# EAGLE board tablet (EAGLE 8.4.3), part 1 of 2
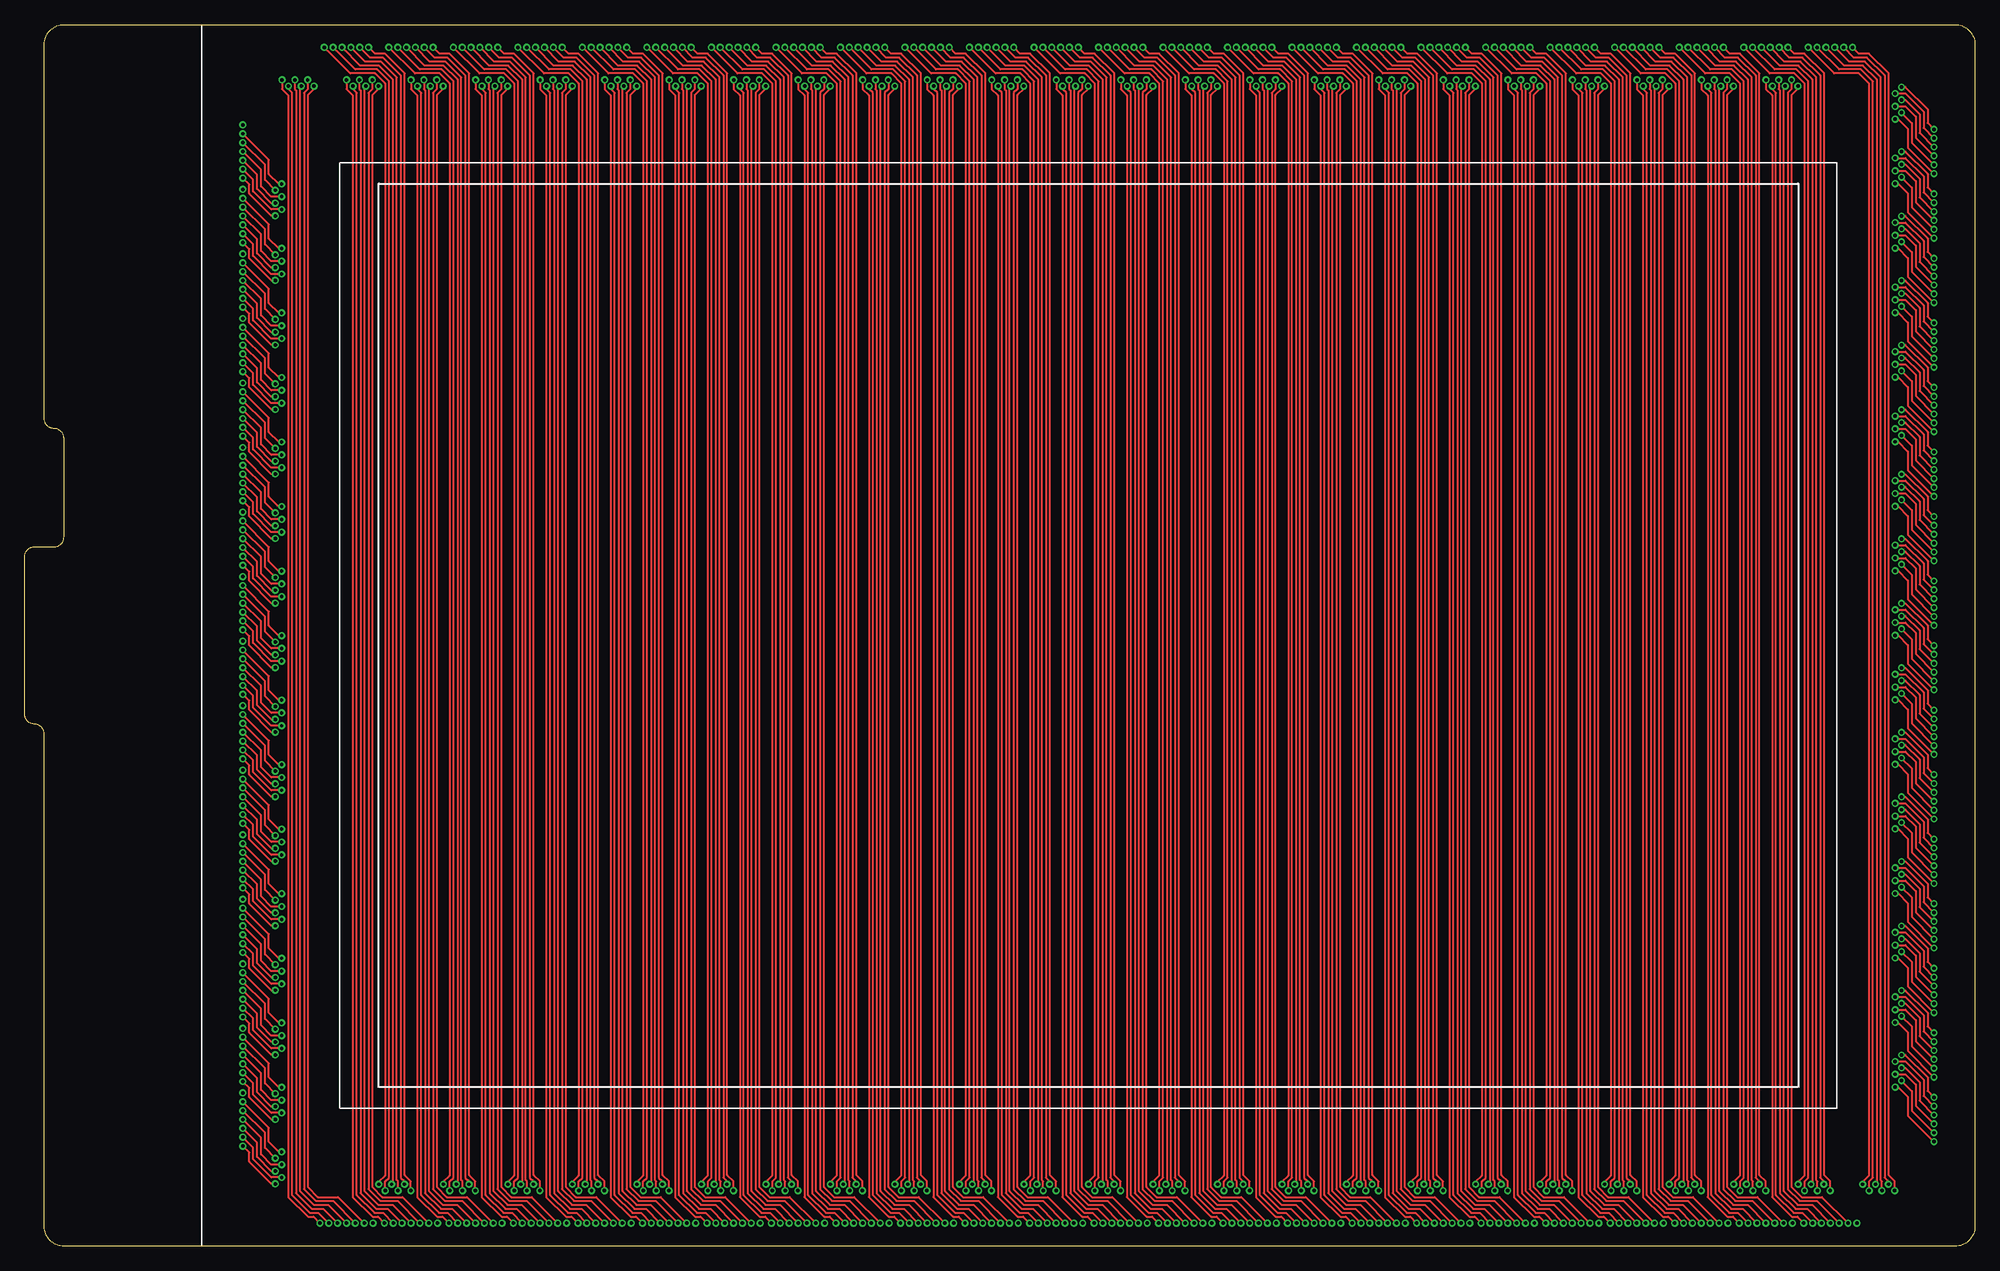
[diagram p1: board, top side]
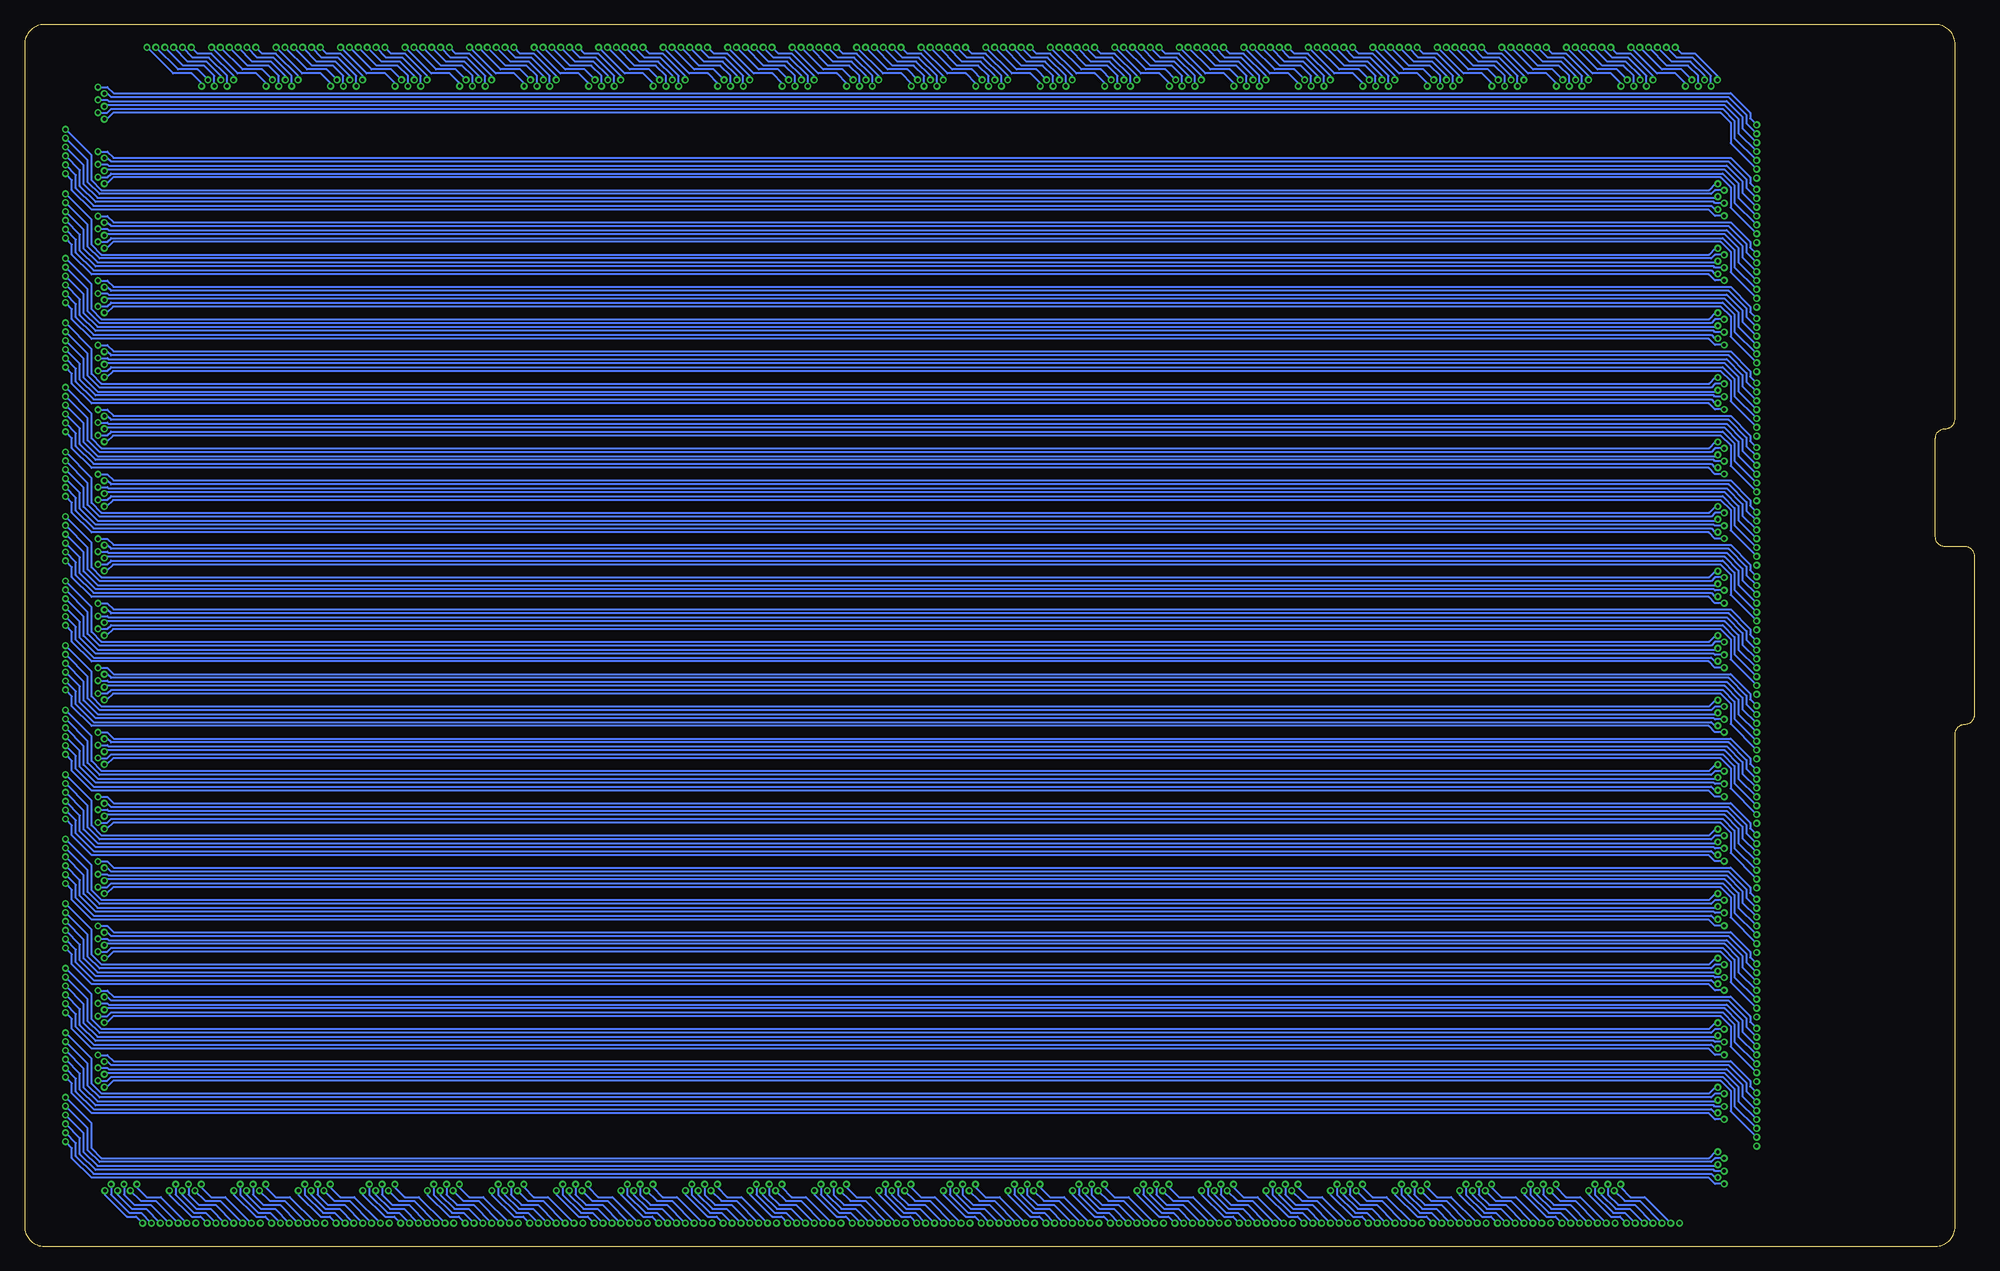
[diagram p2: board, bottom side, seen from below]

Size 198 x 124 mm. Coordinates in mm from the lower left corner, seen from the top.
Outline: 198,122 198,2 arc-90 196,0 4,0 arc-90 2,2 2,52 arc90 1,53 arc-90 0,54 0,70 arc-90 1,71 3,71 arc90 4,72 4,82 arc90 3,83 arc-90 2,84 2,122 arc-90 4,124 196,124 arc-90 198,122
Copper layers (1*16): Top 0.035mm / dielectric 0.9mm / Bottom 0.035mm
Design rules "default *": minimum track width 0.15mm, minimum drill 0.3mm, track to track 0.15mm, track to pad 0.15mm, pad to pad 0.15mm, via to via 0.15mm, smd to smd 0.15mm, copper to edge 0.5mm, drill to drill 0.255mm, minimum pad ring 0.15mm, minimum via ring 0.15mm, stop-mask expansion 0.1mm, vias tented up to drill 0.45mm, thermal gap 0.25mm

## Footprints (pad centres in the part's own frame; a part is rotated, then mirrored left to right if it is on the bottom)
0603 = smd 0.8 x 0.8: 1 -0.75,0; 2 0.75,0
SOT23_3 = smd 0.75 x 1.25: 1 -0.95,-1.25; 2 0.95,-1.25; 3 0,1.25
SOD323 = smd 1.2 x 1.2: 1 -1.25,0; 2 1.25,0
SOIC8 = smd 0.6 x 2.2: 1 -1.905,-2.6; 2 -0.635,-2.6; 3 0.635,-2.6; 4 1.905,-2.6; 5 1.905,2.6; 6 0.635,2.6; 7 -0.635,2.6; 8 -1.905,2.6
SOT23_5 = smd 0.5 x 1.25: 1 -0.95,-1.25; 2 0,-1.25; 3 0.95,-1.25; 4 0.95,1.25; 5 -0.95,1.25

## Placement (x,y rotation side)
C1  ~470pF  [0603]  -1,-32 0 top  (outside the outline)
C2  100nF  [0603]  -21,-38 0 top  (outside the outline)
C3  100nF  [0603]  -21,-41 0 top  (outside the outline)
C4  100nF  [0603]  -21,-44 0 top  (outside the outline)
C5  100nF  [0603]  -26,-54 0 top  (outside the outline)
C6  1uF  [0603]  -26,-57 0 top  (outside the outline)
C7  100nF  [0603]  -26,-60 0 top  (outside the outline)
D1  BAT721S  [SOT23_3]  9,-18 0 top  (outside the outline)
D2  3V9  [SOD323]  0,-35 0 top  (outside the outline)
D3  5V1  [SOD323]  -31,-70 0 top  (outside the outline)
D4  5V1  [SOD323]  -31,-73 0 top  (outside the outline)
IC1  [SOIC8]  -5,-21 0 top  (outside the outline)
IC2  MCP3201  [SOIC8]  -15,-30 0 top  (outside the outline)
IC4  MAX6104EUR  [SOT23_3]  -21,-49 0 top  (outside the outline)
IC5  MAX4514EUK  [SOT23_5]  -25,-65 0 top  (outside the outline)
R1  TBD  [0603]  9,-23 0 top  (outside the outline)
R2  1K  [0603]  9,-26 0 top  (outside the outline)
R3  1K  [0603]  -5,-29 0 top  (outside the outline)

## Tracks (layer width: path | path; a pad name or v marks a point on that pad's centre or on a via)
+5V  (7 unrouted)
-5V  (1 unrouted)
GND  (12 unrouted)
N$1  (2 unrouted)
N$2  (3 unrouted)
N$3  (1 unrouted)
N$4  (4 unrouted)
N$5  (1 unrouted)
N$6  (2 unrouted)
SIG  (1 unrouted)
VOUT  (4 unrouted)
X0  (via drill 0.35 pad 0.7)
  Top 0.2: v30.88,2.35 29.83,3.4 28.96,3.4 27.16,5.2 27.16,117.08 26.79,117.45 v26.79,117.75 | v31.78,2.35 30.33,3.8 29.16,3.8 27.56,5.4 27.56,117.33 27.44,117.45 v27.44,118.4 | v32.67,2.35 30.83,4.2 29.36,4.2 27.96,5.6 27.96,117.62 v28.09,117.75 | v33.58,2.35 31.33,4.6 29.56,4.6 28.36,5.8 28.36,117.08 28.74,117.45 v28.74,118.4 | v34.47,2.35 31.83,5 29.76,5 28.76,6 28.76,116.88 29.39,117.5 v29.39,117.75 | v29.97,2.35 29.33,3 28.76,3 26.76,5 26.76,116.83 26.14,117.45 v26.14,118.4 | v37.26,6.3 37.39,6.42 37.39,118.45 35.99,119.85 34.08,119.85 v32.22,121.7 | v37.91,5.65 37.91,6.6 37.79,6.73 37.79,118.65 36.19,120.25 34.58,120.25 v33.12,121.7 | v38.56,6.3 38.56,6.6 38.19,6.98 38.19,118.85 36.39,120.65 35.08,120.65 v34.03,121.7 | v39.21,5.65 39.21,6.6 38.59,7.23 38.59,119.05 36.59,121.05 35.58,121.05 v34.92,121.7 | v36.61,5.65 36.61,6.6 36.99,6.98 36.99,118.25 35.79,119.45 33.58,119.45 v31.33,121.7 | v35.96,6.3 35.96,6.55 36.59,7.17 36.59,118.05 35.59,119.05 33.08,119.05 v30.42,121.7
  Bottom 0.2: v39.21,5.65 39.21,5.25 36.96,3 36.03,3 v35.38,2.35 | v38.56,6.3 38.56,5.25 36.71,3.4 35.53,3.4 v34.47,2.35 | v37.26,6.3 37.26,5.25 36.21,4.2 34.53,4.2 v32.67,2.35 | v37.91,5.65 37.91,5.25 36.46,3.8 35.03,3.8 v33.58,2.35 | v36.61,5.65 35.56,4.6 34.03,4.6 v31.78,2.35 | v35.96,6.3 35.96,6 34.96,5 33.53,5 v30.88,2.35 | v26.14,118.4 26.14,118.8 28.39,121.05 29.78,121.05 v30.42,121.7 | v26.79,117.75 26.79,118.8 28.64,120.65 30.28,120.65 v31.33,121.7 | v28.09,117.75 28.09,118.8 29.14,119.85 31.28,119.85 v33.12,121.7 | v27.44,118.4 27.44,118.8 28.89,120.25 30.78,120.25 v32.22,121.7 | v28.74,118.4 29.79,119.45 31.78,119.45 v34.03,121.7 | v29.39,117.75 29.39,118.05 30.39,119.05 32.28,119.05 v34.92,121.7
X1  (via drill 0.35 pad 0.7)
  Top 0.2: v37.42,2.35 36.38,3.4 35.51,3.4 33.71,5.2 33.71,117.08 33.34,117.45 v33.34,117.75 | v38.33,2.35 36.88,3.8 35.71,3.8 34.11,5.4 34.11,117.33 33.99,117.45 v33.99,118.4 | v39.22,2.35 37.38,4.2 35.91,4.2 34.51,5.6 34.51,117.62 v34.64,117.75 | v40.12,2.35 37.88,4.6 36.11,4.6 34.91,5.8 34.91,117.08 35.29,117.45 v35.29,118.4 | v41.03,2.35 38.38,5 36.31,5 35.31,6 35.31,116.88 35.94,117.5 v35.94,117.75 | v36.53,2.35 35.88,3 35.31,3 33.31,5 33.31,116.83 32.69,117.45 v32.69,118.4 | v43.81,6.3 43.94,6.42 43.94,118.45 42.54,119.85 40.62,119.85 v38.78,121.7 | v44.46,5.65 44.46,6.6 44.34,6.73 44.34,118.65 42.74,120.25 41.12,120.25 v39.67,121.7 | v45.11,6.3 45.11,6.6 44.74,6.98 44.74,118.85 42.94,120.65 41.62,120.65 v40.58,121.7 | v45.76,5.65 45.76,6.6 45.14,7.23 45.14,119.05 43.14,121.05 42.12,121.05 v41.47,121.7 | v43.16,5.65 43.16,6.6 43.54,6.98 43.54,118.25 42.34,119.45 40.12,119.45 v37.88,121.7 | v42.51,6.3 42.51,6.55 43.14,7.17 43.14,118.05 42.14,119.05 39.62,119.05 v36.97,121.7
  Bottom 0.2: v45.76,5.65 45.76,5.25 43.51,3 42.58,3 v41.92,2.35 | v45.11,6.3 45.11,5.25 43.26,3.4 42.08,3.4 v41.03,2.35 | v43.81,6.3 43.81,5.25 42.76,4.2 41.08,4.2 v39.22,2.35 | v44.46,5.65 44.46,5.25 43.01,3.8 41.58,3.8 v40.12,2.35 | v43.16,5.65 42.11,4.6 40.58,4.6 v38.33,2.35 | v42.51,6.3 42.51,6 41.51,5 40.08,5 v37.42,2.35 | v32.69,118.4 32.69,118.8 34.94,121.05 36.33,121.05 v36.97,121.7 | v33.34,117.75 33.34,118.8 35.19,120.65 36.83,120.65 v37.88,121.7 | v34.64,117.75 34.64,118.8 35.69,119.85 37.83,119.85 v39.67,121.7 | v33.99,118.4 33.99,118.8 35.44,120.25 37.33,120.25 v38.78,121.7 | v35.29,118.4 36.34,119.45 38.33,119.45 v40.58,121.7 | v35.94,117.75 35.94,118.05 36.94,119.05 38.83,119.05 v41.47,121.7
X2  (via drill 0.35 pad 0.7)
  Top 0.2: v43.97,2.35 42.92,3.4 42.06,3.4 40.26,5.2 40.26,117.08 39.89,117.45 v39.89,117.75 | v44.88,2.35 43.42,3.8 42.26,3.8 40.66,5.4 40.66,117.33 40.54,117.45 v40.54,118.4 | v45.77,2.35 43.92,4.2 42.46,4.2 41.06,5.6 41.06,117.62 v41.19,117.75 | v46.67,2.35 44.42,4.6 42.66,4.6 41.46,5.8 41.46,117.08 41.84,117.45 v41.84,118.4 | v47.58,2.35 44.92,5 42.86,5 41.86,6 41.86,116.88 42.49,117.5 v42.49,117.75 | v43.08,2.35 42.42,3 41.86,3 39.86,5 39.86,116.83 39.24,117.45 v39.24,118.4 | v50.36,6.3 50.49,6.42 50.49,118.45 49.09,119.85 47.17,119.85 v45.33,121.7 | v51.01,5.65 51.01,6.6 50.89,6.73 50.89,118.65 49.29,120.25 47.67,120.25 v46.23,121.7 | v51.66,6.3 51.66,6.6 51.29,6.98 51.29,118.85 49.49,120.65 48.17,120.65 v47.12,121.7 | v52.31,5.65 52.31,6.6 51.69,7.23 51.69,119.05 49.69,121.05 48.67,121.05 v48.02,121.7 | v49.71,5.65 49.71,6.6 50.09,6.98 50.09,118.25 48.89,119.45 46.67,119.45 v44.42,121.7 | v49.06,6.3 49.06,6.55 49.69,7.17 49.69,118.05 48.69,119.05 46.17,119.05 v43.53,121.7
  Bottom 0.2: v52.31,5.65 52.31,5.25 50.06,3 49.12,3 v48.48,2.35 | v51.66,6.3 51.66,5.25 49.81,3.4 48.62,3.4 v47.58,2.35 | v50.36,6.3 50.36,5.25 49.31,4.2 47.62,4.2 v45.77,2.35 | v51.01,5.65 51.01,5.25 49.56,3.8 48.12,3.8 v46.67,2.35 | v49.71,5.65 48.66,4.6 47.12,4.6 v44.88,2.35 | v49.06,6.3 49.06,6 48.06,5 46.62,5 v43.97,2.35 | v39.24,118.4 39.24,118.8 41.49,121.05 42.88,121.05 v43.53,121.7 | v39.89,117.75 39.89,118.8 41.74,120.65 43.38,120.65 v44.42,121.7 | v41.19,117.75 41.19,118.8 42.24,119.85 44.38,119.85 v46.23,121.7 | v40.54,118.4 40.54,118.8 41.99,120.25 43.88,120.25 v45.33,121.7 | v41.84,118.4 42.89,119.45 44.88,119.45 v47.12,121.7 | v42.49,117.75 42.49,118.05 43.49,119.05 45.38,119.05 v48.02,121.7
X3  (via drill 0.35 pad 0.7)
  Top 0.2: v50.52,2.35 49.48,3.4 48.61,3.4 46.81,5.2 46.81,117.08 46.44,117.45 v46.44,117.75 | v51.42,2.35 49.98,3.8 48.81,3.8 47.21,5.4 47.21,117.33 47.09,117.45 v47.09,118.4 | v52.33,2.35 50.48,4.2 49.01,4.2 47.61,5.6 47.61,117.62 v47.74,117.75 | v53.23,2.35 50.98,4.6 49.21,4.6 48.01,5.8 48.01,117.08 48.39,117.45 v48.39,118.4 | v54.12,2.35 51.48,5 49.41,5 48.41,6 48.41,116.88 49.04,117.5 v49.04,117.75 | v49.62,2.35 48.98,3 48.41,3 46.41,5 46.41,116.83 45.79,117.45 v45.79,118.4 | v56.91,6.3 57.04,6.42 57.04,118.45 55.64,119.85 53.73,119.85 v51.88,121.7 | v57.56,5.65 57.56,6.6 57.44,6.73 57.44,118.65 55.84,120.25 54.23,120.25 v52.77,121.7 | v58.21,6.3 58.21,6.6 57.84,6.98 57.84,118.85 56.04,120.65 54.73,120.65 v53.67,121.7 | v58.86,5.65 58.86,6.6 58.24,7.23 58.24,119.05 56.24,121.05 55.23,121.05 v54.58,121.7 | v56.26,5.65 56.26,6.6 56.64,6.98 56.64,118.25 55.44,119.45 53.23,119.45 v50.98,121.7 | v55.61,6.3 55.61,6.55 56.24,7.17 56.24,118.05 55.24,119.05 52.73,119.05 v50.08,121.7
  Bottom 0.2: v58.86,5.65 58.86,5.25 56.61,3 55.67,3 v55.02,2.35 | v58.21,6.3 58.21,5.25 56.36,3.4 55.17,3.4 v54.12,2.35 | v56.91,6.3 56.91,5.25 55.86,4.2 54.17,4.2 v52.33,2.35 | v57.56,5.65 57.56,5.25 56.11,3.8 54.67,3.8 v53.23,2.35 | v56.26,5.65 55.21,4.6 53.67,4.6 v51.42,2.35 | v55.61,6.3 55.61,6 54.61,5 53.17,5 v50.52,2.35 | v45.79,118.4 45.79,118.8 48.04,121.05 49.42,121.05 v50.08,121.7 | v46.44,117.75 46.44,118.8 48.29,120.65 49.92,120.65 v50.98,121.7 | v47.74,117.75 47.74,118.8 48.79,119.85 50.92,119.85 v52.77,121.7 | v47.09,118.4 47.09,118.8 48.54,120.25 50.42,120.25 v51.88,121.7 | v48.39,118.4 49.44,119.45 51.42,119.45 v53.67,121.7 | v49.04,117.75 49.04,118.05 50.04,119.05 51.92,119.05 v54.58,121.7
X4  (via drill 0.35 pad 0.7)
  Top 0.2: v57.08,2.35 56.02,3.4 55.16,3.4 53.36,5.2 53.36,117.08 52.99,117.45 v52.99,117.75 | v57.98,2.35 56.52,3.8 55.36,3.8 53.76,5.4 53.76,117.33 53.64,117.45 v53.64,118.4 | v58.88,2.35 57.02,4.2 55.56,4.2 54.16,5.6 54.16,117.62 v54.29,117.75 | v59.77,2.35 57.52,4.6 55.76,4.6 54.56,5.8 54.56,117.08 54.94,117.45 v54.94,118.4 | v60.67,2.35 58.02,5 55.96,5 54.96,6 54.96,116.88 55.59,117.5 v55.59,117.75 | v56.17,2.35 55.52,3 54.96,3 52.96,5 52.96,116.83 52.34,117.45 v52.34,118.4 | v63.46,6.3 63.59,6.42 63.59,118.45 62.19,119.85 60.27,119.85 v58.42,121.7 | v64.11,5.65 64.11,6.6 63.99,6.73 63.99,118.65 62.39,120.25 60.77,120.25 v59.33,121.7 | v64.76,6.3 64.76,6.6 64.39,6.98 64.39,118.85 62.59,120.65 61.27,120.65 v60.23,121.7 | v65.41,5.65 65.41,6.6 64.79,7.23 64.79,119.05 62.79,121.05 61.77,121.05 v61.12,121.7 | v62.81,5.65 62.81,6.6 63.19,6.98 63.19,118.25 61.99,119.45 59.77,119.45 v57.52,121.7 | v62.16,6.3 62.16,6.55 62.79,7.17 62.79,118.05 61.79,119.05 59.27,119.05 v56.62,121.7
  Bottom 0.2: v65.41,5.65 65.41,5.25 63.16,3 62.23,3 v61.58,2.35 | v64.76,6.3 64.76,5.25 62.91,3.4 61.73,3.4 v60.67,2.35 | v63.46,6.3 63.46,5.25 62.41,4.2 60.73,4.2 v58.88,2.35 | v64.11,5.65 64.11,5.25 62.66,3.8 61.23,3.8 v59.77,2.35 | v62.81,5.65 61.76,4.6 60.23,4.6 v57.98,2.35 | v62.16,6.3 62.16,6 61.16,5 59.73,5 v57.08,2.35 | v52.34,118.4 52.34,118.8 54.59,121.05 55.98,121.05 v56.62,121.7 | v52.99,117.75 52.99,118.8 54.84,120.65 56.48,120.65 v57.52,121.7 | v54.29,117.75 54.29,118.8 55.34,119.85 57.48,119.85 v59.33,121.7 | v53.64,118.4 53.64,118.8 55.09,120.25 56.98,120.25 v58.42,121.7 | v54.94,118.4 55.99,119.45 57.98,119.45 v60.23,121.7 | v55.59,117.75 55.59,118.05 56.59,119.05 58.48,119.05 v61.12,121.7
X5  (via drill 0.35 pad 0.7)
  Top 0.2: v63.62,2.35 62.58,3.4 61.71,3.4 59.91,5.2 59.91,117.08 59.54,117.45 v59.54,117.75 | v64.53,2.35 63.08,3.8 61.91,3.8 60.31,5.4 60.31,117.33 60.19,117.45 v60.19,118.4 | v65.42,2.35 63.58,4.2 62.11,4.2 60.71,5.6 60.71,117.62 v60.84,117.75 | v66.33,2.35 64.08,4.6 62.31,4.6 61.11,5.8 61.11,117.08 61.49,117.45 v61.49,118.4 | v67.22,2.35 64.58,5 62.51,5 61.51,6 61.51,116.88 62.14,117.5 v62.14,117.75 | v62.73,2.35 62.08,3 61.51,3 59.51,5 59.51,116.83 58.89,117.45 v58.89,118.4 | v70.01,6.3 70.14,6.42 70.14,118.45 68.74,119.85 66.83,119.85 v64.97,121.7 | v70.66,5.65 70.66,6.6 70.54,6.73 70.54,118.65 68.94,120.25 67.33,120.25 v65.88,121.7 | v71.31,6.3 71.31,6.6 70.94,6.98 70.94,118.85 69.14,120.65 67.83,120.65 v66.78,121.7 | v71.96,5.65 71.96,6.6 71.34,7.23 71.34,119.05 69.34,121.05 68.33,121.05 v67.67,121.7 | v69.36,5.65 69.36,6.6 69.74,6.98 69.74,118.25 68.54,119.45 66.33,119.45 v64.08,121.7 | v68.71,6.3 68.71,6.55 69.34,7.17 69.34,118.05 68.34,119.05 65.83,119.05 v63.17,121.7
  Bottom 0.2: v71.96,5.65 71.96,5.25 69.71,3 68.78,3 v68.12,2.35 | v71.31,6.3 71.31,5.25 69.46,3.4 68.28,3.4 v67.22,2.35 | v70.01,6.3 70.01,5.25 68.96,4.2 67.28,4.2 v65.42,2.35 | v70.66,5.65 70.66,5.25 69.21,3.8 67.78,3.8 v66.33,2.35 | v69.36,5.65 68.31,4.6 66.78,4.6 v64.53,2.35 | v68.71,6.3 68.71,6 67.71,5 66.28,5 v63.62,2.35 | v58.89,118.4 58.89,118.8 61.14,121.05 62.52,121.05 v63.17,121.7 | v59.54,117.75 59.54,118.8 61.39,120.65 63.02,120.65 v64.08,121.7 | v60.84,117.75 60.84,118.8 61.89,119.85 64.03,119.85 v65.88,121.7 | v60.19,118.4 60.19,118.8 61.64,120.25 63.52,120.25 v64.97,121.7 | v61.49,118.4 62.54,119.45 64.53,119.45 v66.78,121.7 | v62.14,117.75 62.14,118.05 63.14,119.05 65.03,119.05 v67.67,121.7
X6  (via drill 0.35 pad 0.7)
  Top 0.2: v70.17,2.35 69.12,3.4 68.26,3.4 66.46,5.2 66.46,117.08 66.09,117.45 v66.09,117.75 | v71.08,2.35 69.62,3.8 68.46,3.8 66.86,5.4 66.86,117.33 66.74,117.45 v66.74,118.4 | v71.97,2.35 70.12,4.2 68.66,4.2 67.26,5.6 67.26,117.62 v67.39,117.75 | v72.88,2.35 70.62,4.6 68.86,4.6 67.66,5.8 67.66,117.08 68.04,117.45 v68.04,118.4 | v73.78,2.35 71.12,5 69.06,5 68.06,6 68.06,116.88 68.69,117.5 v68.69,117.75 | v69.28,2.35 68.62,3 68.06,3 66.06,5 66.06,116.83 65.44,117.45 v65.44,118.4 | v76.56,6.3 76.69,6.42 76.69,118.45 75.29,119.85 73.38,119.85 v71.53,121.7 | v77.21,5.65 77.21,6.6 77.09,6.73 77.09,118.65 75.49,120.25 73.88,120.25 v72.42,121.7 | v77.86,6.3 77.86,6.6 77.49,6.98 77.49,118.85 75.69,120.65 74.38,120.65 v73.33,121.7 | v78.51,5.65 78.51,6.6 77.89,7.23 77.89,119.05 75.89,121.05 74.88,121.05 v74.22,121.7 | v75.91,5.65 75.91,6.6 76.29,6.98 76.29,118.25 75.09,119.45 72.88,119.45 v70.62,121.7 | v75.26,6.3 75.26,6.55 75.89,7.17 75.89,118.05 74.89,119.05 72.38,119.05 v69.72,121.7
  Bottom 0.2: v78.51,5.65 78.51,5.25 76.26,3 75.33,3 v74.67,2.35 | v77.86,6.3 77.86,5.25 76.01,3.4 74.83,3.4 v73.78,2.35 | v76.56,6.3 76.56,5.25 75.51,4.2 73.83,4.2 v71.97,2.35 | v77.21,5.65 77.21,5.25 75.76,3.8 74.33,3.8 v72.88,2.35 | v75.91,5.65 74.86,4.6 73.33,4.6 v71.08,2.35 | v75.26,6.3 75.26,6 74.26,5 72.83,5 v70.17,2.35 | v65.44,118.4 65.44,118.8 67.69,121.05 69.08,121.05 v69.72,121.7 | v66.09,117.75 66.09,118.8 67.94,120.65 69.58,120.65 v70.62,121.7 | v67.39,117.75 67.39,118.8 68.44,119.85 70.58,119.85 v72.42,121.7 | v66.74,118.4 66.74,118.8 68.19,120.25 70.08,120.25 v71.53,121.7 | v68.04,118.4 69.09,119.45 71.08,119.45 v73.33,121.7 | v68.69,117.75 68.69,118.05 69.69,119.05 71.58,119.05 v74.22,121.7
X7  (via drill 0.35 pad 0.7)
  Top 0.2: v76.72,2.35 75.67,3.4 74.81,3.4 73.01,5.2 73.01,117.08 72.64,117.45 v72.64,117.75 | v77.62,2.35 76.17,3.8 75.01,3.8 73.41,5.4 73.41,117.33 73.29,117.45 v73.29,118.4 | v78.53,2.35 76.67,4.2 75.21,4.2 73.81,5.6 73.81,117.62 v73.94,117.75 | v79.42,2.35 77.17,4.6 75.41,4.6 74.21,5.8 74.21,117.08 74.59,117.45 v74.59,118.4 | v80.33,2.35 77.67,5 75.61,5 74.61,6 74.61,116.88 75.24,117.5 v75.24,117.75 | v75.83,2.35 75.17,3 74.61,3 72.61,5 72.61,116.83 71.99,117.45 v71.99,118.4 | v83.11,6.3 83.24,6.42 83.24,118.45 81.84,119.85 79.92,119.85 v78.08,121.7 | v83.76,5.65 83.76,6.6 83.64,6.73 83.64,118.65 82.04,120.25 80.42,120.25 v78.97,121.7 | v84.41,6.3 84.41,6.6 84.04,6.98 84.04,118.85 82.24,120.65 80.92,120.65 v79.88,121.7 | v85.06,5.65 85.06,6.6 84.44,7.23 84.44,119.05 82.44,121.05 81.42,121.05 v80.78,121.7 | v82.46,5.65 82.46,6.6 82.84,6.98 82.84,118.25 81.64,119.45 79.42,119.45 v77.17,121.7 | v81.81,6.3 81.81,6.55 82.44,7.17 82.44,118.05 81.44,119.05 78.92,119.05 v76.28,121.7
  Bottom 0.2: v85.06,5.65 85.06,5.25 82.81,3 81.88,3 v81.22,2.35 | v84.41,6.3 84.41,5.25 82.56,3.4 81.38,3.4 v80.33,2.35 | v83.11,6.3 83.11,5.25 82.06,4.2 80.38,4.2 v78.53,2.35 | v83.76,5.65 83.76,5.25 82.31,3.8 80.88,3.8 v79.42,2.35 | v82.46,5.65 81.41,4.6 79.88,4.6 v77.62,2.35 | v81.81,6.3 81.81,6 80.81,5 79.38,5 v76.72,2.35 | v71.99,118.4 71.99,118.8 74.24,121.05 75.62,121.05 v76.28,121.7 | v72.64,117.75 72.64,118.8 74.49,120.65 76.12,120.65 v77.17,121.7 | v73.94,117.75 73.94,118.8 74.99,119.85 77.12,119.85 v78.97,121.7 | v73.29,118.4 73.29,118.8 74.74,120.25 76.62,120.25 v78.08,121.7 | v74.59,118.4 75.64,119.45 77.62,119.45 v79.88,121.7 | v75.24,117.75 75.24,118.05 76.24,119.05 78.12,119.05 v80.78,121.7
X8  (via drill 0.35 pad 0.7)
  Top 0.2: v83.28,2.35 82.22,3.4 81.36,3.4 79.56,5.2 79.56,117.08 79.19,117.45 v79.19,117.75 | v84.17,2.35 82.72,3.8 81.56,3.8 79.96,5.4 79.96,117.33 79.84,117.45 v79.84,118.4 | v85.08,2.35 83.22,4.2 81.76,4.2 80.36,5.6 80.36,117.62 v80.49,117.75 | v85.97,2.35 83.72,4.6 81.96,4.6 80.76,5.8 80.76,117.08 81.14,117.45 v81.14,118.4 | v86.88,2.35 84.22,5 82.16,5 81.16,6 81.16,116.88 81.79,117.5 v81.79,117.75 | v82.38,2.35 81.72,3 81.16,3 79.16,5 79.16,116.83 78.54,117.45 v78.54,118.4 | v89.66,6.3 89.79,6.42 89.79,118.45 88.39,119.85 86.47,119.85 v84.62,121.7 | v90.31,5.65 90.31,6.6 90.19,6.73 90.19,118.65 88.59,120.25 86.97,120.25 v85.53,121.7 | v90.96,6.3 90.96,6.6 90.59,6.98 90.59,118.85 88.79,120.65 87.47,120.65 v86.42,121.7 | v91.61,5.65 91.61,6.6 90.99,7.23 90.99,119.05 88.99,121.05 87.97,121.05 v87.33,121.7 | v89.01,5.65 89.01,6.6 89.39,6.98 89.39,118.25 88.19,119.45 85.97,119.45 v83.72,121.7 | v88.36,6.3 88.36,6.55 88.99,7.17 88.99,118.05 87.99,119.05 85.47,119.05 v82.83,121.7
  Bottom 0.2: v91.61,5.65 91.61,5.25 89.36,3 88.42,3 v87.78,2.35 | v90.96,6.3 90.96,5.25 89.11,3.4 87.92,3.4 v86.88,2.35 | v89.66,6.3 89.66,5.25 88.61,4.2 86.92,4.2 v85.08,2.35 | v90.31,5.65 90.31,5.25 88.86,3.8 87.42,3.8 v85.97,2.35 | v89.01,5.65 87.96,4.6 86.42,4.6 v84.17,2.35 | v88.36,6.3 88.36,6 87.36,5 85.92,5 v83.28,2.35 | v78.54,118.4 78.54,118.8 80.79,121.05 82.17,121.05 v82.83,121.7 | v79.19,117.75 79.19,118.8 81.04,120.65 82.67,120.65 v83.72,121.7 | v80.49,117.75 80.49,118.8 81.54,119.85 83.67,119.85 v85.53,121.7 | v79.84,118.4 79.84,118.8 81.29,120.25 83.17,120.25 v84.62,121.7 | v81.14,118.4 82.19,119.45 84.17,119.45 v86.42,121.7 | v81.79,117.75 81.79,118.05 82.79,119.05 84.67,119.05 v87.33,121.7
X9  (via drill 0.35 pad 0.7)
  Top 0.2: v89.83,2.35 88.78,3.4 87.91,3.4 86.11,5.2 86.11,117.08 85.74,117.45 v85.74,117.75 | v90.72,2.35 89.28,3.8 88.11,3.8 86.51,5.4 86.51,117.33 86.39,117.45 v86.39,118.4 | v91.62,2.35 89.78,4.2 88.31,4.2 86.91,5.6 86.91,117.62 v87.04,117.75 | v92.53,2.35 90.28,4.6 88.51,4.6 87.31,5.8 87.31,117.08 87.69,117.45 v87.69,118.4 | v93.42,2.35 90.78,5 88.71,5 87.71,6 87.71,116.88 88.34,117.5 v88.34,117.75 | v88.92,2.35 88.28,3 87.71,3 85.71,5 85.71,116.83 85.09,117.45 v85.09,118.4 | v96.21,6.3 96.34,6.42 96.34,118.45 94.94,119.85 93.03,119.85 v91.17,121.7 | v96.86,5.65 96.86,6.6 96.74,6.73 96.74,118.65 95.14,120.25 93.53,120.25 v92.08,121.7 | v97.51,6.3 97.51,6.6 97.14,6.98 97.14,118.85 95.34,120.65 94.03,120.65 v92.97,121.7 | v98.16,5.65 98.16,6.6 97.54,7.23 97.54,119.05 95.54,121.05 94.53,121.05 v93.88,121.7 | v95.56,5.65 95.56,6.6 95.94,6.98 95.94,118.25 94.74,119.45 92.53,119.45 v90.28,121.7 | v94.91,6.3 94.91,6.55 95.54,7.17 95.54,118.05 94.54,119.05 92.03,119.05 v89.38,121.7
  Bottom 0.2: v98.16,5.65 98.16,5.25 95.91,3 94.97,3 v94.33,2.35 | v97.51,6.3 97.51,5.25 95.66,3.4 94.47,3.4 v93.42,2.35 | v96.21,6.3 96.21,5.25 95.16,4.2 93.47,4.2 v91.62,2.35 | v96.86,5.65 96.86,5.25 95.41,3.8 93.97,3.8 v92.53,2.35 | v95.56,5.65 94.51,4.6 92.97,4.6 v90.72,2.35 | v94.91,6.3 94.91,6 93.91,5 92.47,5 v89.83,2.35 | v85.09,118.4 85.09,118.8 87.34,121.05 88.72,121.05 v89.38,121.7 | v85.74,117.75 85.74,118.8 87.59,120.65 89.22,120.65 v90.28,121.7 | v87.04,117.75 87.04,118.8 88.09,119.85 90.22,119.85 v92.08,121.7 | v86.39,118.4 86.39,118.8 87.84,120.25 89.72,120.25 v91.17,121.7 | v87.69,118.4 88.74,119.45 90.72,119.45 v92.97,121.7 | v88.34,117.75 88.34,118.05 89.34,119.05 91.22,119.05 v93.88,121.7
X10  (via drill 0.35 pad 0.7)
  Top 0.2: v96.38,2.35 95.33,3.4 94.46,3.4 92.66,5.2 92.66,117.08 92.29,117.45 v92.29,117.75 | v97.28,2.35 95.83,3.8 94.66,3.8 93.06,5.4 93.06,117.33 92.94,117.45 v92.94,118.4 | v98.17,2.35 96.33,4.2 94.86,4.2 93.46,5.6 93.46,117.62 v93.59,117.75 | v99.08,2.35 96.83,4.6 95.06,4.6 93.86,5.8 93.86,117.08 94.24,117.45 v94.24,118.4 | v99.97,2.35 97.33,5 95.26,5 94.26,6 94.26,116.88 94.89,117.5 v94.89,117.75 | v95.47,2.35 94.83,3 94.26,3 92.26,5 92.26,116.83 91.64,117.45 v91.64,118.4 | v102.76,6.3 102.89,6.42 102.89,118.45 101.49,119.85 99.58,119.85 v97.72,121.7 | v103.41,5.65 103.41,6.6 103.29,6.73 103.29,118.65 101.69,120.25 100.08,120.25 v98.62,121.7 | v104.06,6.3 104.06,6.6 103.69,6.98 103.69,118.85 101.89,120.65 100.58,120.65 v99.53,121.7 | v104.71,5.65 104.71,6.6 104.09,7.23 104.09,119.05 102.09,121.05 101.08,121.05 v100.42,121.7 | v102.11,5.65 102.11,6.6 102.49,6.98 102.49,118.25 101.29,119.45 99.08,119.45 v96.83,121.7 | v101.46,6.3 101.46,6.55 102.09,7.17 102.09,118.05 101.09,119.05 98.58,119.05 v95.92,121.7
  Bottom 0.2: v104.71,5.65 104.71,5.25 102.46,3 101.53,3 v100.88,2.35 | v104.06,6.3 104.06,5.25 102.21,3.4 101.03,3.4 v99.97,2.35 | v102.76,6.3 102.76,5.25 101.71,4.2 100.03,4.2 v98.17,2.35 | v103.41,5.65 103.41,5.25 101.96,3.8 100.53,3.8 v99.08,2.35 | v102.11,5.65 101.06,4.6 99.53,4.6 v97.28,2.35 | v101.46,6.3 101.46,6 100.46,5 99.03,5 v96.38,2.35 | v91.64,118.4 91.64,118.8 93.89,121.05 95.28,121.05 v95.92,121.7 | v92.29,117.75 92.29,118.8 94.14,120.65 95.78,120.65 v96.83,121.7 | v93.59,117.75 93.59,118.8 94.64,119.85 96.78,119.85 v98.62,121.7 | v92.94,118.4 92.94,118.8 94.39,120.25 96.28,120.25 v97.72,121.7 | v94.24,118.4 95.29,119.45 97.28,119.45 v99.53,121.7 | v94.89,117.75 94.89,118.05 95.89,119.05 97.78,119.05 v100.42,121.7
X11  (via drill 0.35 pad 0.7)
  Top 0.2: v102.92,2.35 101.88,3.4 101.01,3.4 99.21,5.2 99.21,117.08 98.84,117.45 v98.84,117.75 | v103.83,2.35 102.38,3.8 101.21,3.8 99.61,5.4 99.61,117.33 99.49,117.45 v99.49,118.4 | v104.72,2.35 102.88,4.2 101.41,4.2 100.01,5.6 100.01,117.62 v100.14,117.75 | v105.62,2.35 103.38,4.6 101.61,4.6 100.41,5.8 100.41,117.08 100.79,117.45 v100.79,118.4 | v106.53,2.35 103.88,5 101.81,5 100.81,6 100.81,116.88 101.44,117.5 v101.44,117.75 | v102.03,2.35 101.38,3 100.81,3 98.81,5 98.81,116.83 98.19,117.45 v98.19,118.4 | v109.31,6.3 109.44,6.42 109.44,118.45 108.04,119.85 106.12,119.85 v104.28,121.7 | v109.96,5.65 109.96,6.6 109.84,6.73 109.84,118.65 108.24,120.25 106.62,120.25 v105.17,121.7 | v110.61,6.3 110.61,6.6 110.24,6.98 110.24,118.85 108.44,120.65 107.12,120.65 v106.08,121.7 | v111.26,5.65 111.26,6.6 110.64,7.23 110.64,119.05 108.64,121.05 107.62,121.05 v106.97,121.7 | v108.66,5.65 108.66,6.6 109.04,6.98 109.04,118.25 107.84,119.45 105.62,119.45 v103.38,121.7 | v108.01,6.3 108.01,6.55 108.64,7.17 108.64,118.05 107.64,119.05 105.12,119.05 v102.47,121.7
  Bottom 0.2: v111.26,5.65 111.26,5.25 109.01,3 108.08,3 v107.42,2.35 | v110.61,6.3 110.61,5.25 108.76,3.4 107.58,3.4 v106.53,2.35 | v109.31,6.3 109.31,5.25 108.26,4.2 106.58,4.2 v104.72,2.35 | v109.96,5.65 109.96,5.25 108.51,3.8 107.08,3.8 v105.62,2.35 | v108.66,5.65 107.61,4.6 106.08,4.6 v103.83,2.35 | v108.01,6.3 108.01,6 107.01,5 105.58,5 v102.92,2.35 | v98.19,118.4 98.19,118.8 100.44,121.05 101.83,121.05 v102.47,121.7 | v98.84,117.75 98.84,118.8 100.69,120.65 102.33,120.65 v103.38,121.7 | v100.14,117.75 100.14,118.8 101.19,119.85 103.33,119.85 v105.17,121.7 | v99.49,118.4 99.49,118.8 100.94,120.25 102.83,120.25 v104.28,121.7 | v100.79,118.4 101.84,119.45 103.83,119.45 v106.08,121.7 | v101.44,117.75 101.44,118.05 102.44,119.05 104.33,119.05 v106.97,121.7
X12  (via drill 0.35 pad 0.7)
  Top 0.2: v109.47,2.35 108.42,3.4 107.56,3.4 105.76,5.2 105.76,117.08 105.39,117.45 v105.39,117.75 | v110.38,2.35 108.92,3.8 107.76,3.8 106.16,5.4 106.16,117.33 106.04,117.45 v106.04,118.4 | v111.28,2.35 109.42,4.2 107.96,4.2 106.56,5.6 106.56,117.62 v106.69,117.75 | v112.17,2.35 109.92,4.6 108.16,4.6 106.96,5.8 106.96,117.08 107.34,117.45 v107.34,118.4 | v113.08,2.35 110.42,5 108.36,5 107.36,6 107.36,116.88 107.99,117.5 v107.99,117.75 | v108.58,2.35 107.92,3 107.36,3 105.36,5 105.36,116.83 104.74,117.45 v104.74,118.4 | v115.86,6.3 115.99,6.42 115.99,118.45 114.59,119.85 112.67,119.85 v110.83,121.7 | v116.51,5.65 116.51,6.6 116.39,6.73 116.39,118.65 114.79,120.25 113.17,120.25 v111.72,121.7 | v117.16,6.3 117.16,6.6 116.79,6.98 116.79,118.85 114.99,120.65 113.67,120.65 v112.62,121.7 | v117.81,5.65 117.81,6.6 117.19,7.23 117.19,119.05 115.19,121.05 114.17,121.05 v113.53,121.7 | v115.21,5.65 115.21,6.6 115.59,6.98 115.59,118.25 114.39,119.45 112.17,119.45 v109.92,121.7 | v114.56,6.3 114.56,6.55 115.19,7.17 115.19,118.05 114.19,119.05 111.67,119.05 v109.03,121.7
  Bottom 0.2: v117.81,5.65 117.81,5.25 115.56,3 114.62,3 v113.97,2.35 | v117.16,6.3 117.16,5.25 115.31,3.4 114.12,3.4 v113.08,2.35 | v115.86,6.3 115.86,5.25 114.81,4.2 113.12,4.2 v111.28,2.35 | v116.51,5.65 116.51,5.25 115.06,3.8 113.62,3.8 v112.17,2.35 | v115.21,5.65 114.16,4.6 112.62,4.6 v110.38,2.35 | v114.56,6.3 114.56,6 113.56,5 112.12,5 v109.47,2.35 | v104.74,118.4 104.74,118.8 106.99,121.05 108.38,121.05 v109.03,121.7 | v105.39,117.75 105.39,118.8 107.24,120.65 108.88,120.65 v109.92,121.7 | v106.69,117.75 106.69,118.8 107.74,119.85 109.88,119.85 v111.72,121.7 | v106.04,118.4 106.04,118.8 107.49,120.25 109.38,120.25 v110.83,121.7 | v107.34,118.4 108.39,119.45 110.38,119.45 v112.62,121.7 | v107.99,117.75 107.99,118.05 108.99,119.05 110.88,119.05 v113.53,121.7
X13  (via drill 0.35 pad 0.7)
  Top 0.2: v116.03,2.35 114.97,3.4 114.11,3.4 112.31,5.2 112.31,117.08 111.94,117.45 v111.94,117.75 | v116.92,2.35 115.47,3.8 114.31,3.8 112.71,5.4 112.71,117.33 112.59,117.45 v112.59,118.4 | v117.83,2.35 115.97,4.2 114.51,4.2 113.11,5.6 113.11,117.62 v113.24,117.75 | v118.72,2.35 116.47,4.6 114.71,4.6 113.51,5.8 113.51,117.08 113.89,117.45 v113.89,118.4 | v119.62,2.35 116.97,5 114.91,5 113.91,6 113.91,116.88 114.54,117.5 v114.54,117.75 | v115.12,2.35 114.47,3 113.91,3 111.91,5 111.91,116.83 111.29,117.45 v111.29,118.4 | v122.41,6.3 122.54,6.42 122.54,118.45 121.14,119.85 119.22,119.85 v117.38,121.7 | v123.06,5.65 123.06,6.6 122.94,6.73 122.94,118.65 121.34,120.25 119.72,120.25 v118.28,121.7 | v123.71,6.3 123.71,6.6 123.34,6.98 123.34,118.85 121.54,120.65 120.22,120.65 v119.17,121.7 | v124.36,5.65 124.36,6.6 123.74,7.23 123.74,119.05 121.74,121.05 120.72,121.05 v120.08,121.7 | v121.76,5.65 121.76,6.6 122.14,6.98 122.14,118.25 120.94,119.45 118.72,119.45 v116.47,121.7 | v121.11,6.3 121.11,6.55 121.74,7.17 121.74,118.05 120.74,119.05 118.22,119.05 v115.58,121.7
  Bottom 0.2: v124.36,5.65 124.36,5.25 122.11,3 121.17,3 v120.53,2.35 | v123.71,6.3 123.71,5.25 121.86,3.4 120.67,3.4 v119.62,2.35 | v122.41,6.3 122.41,5.25 121.36,4.2 119.67,4.2 v117.83,2.35 | v123.06,5.65 123.06,5.25 121.61,3.8 120.17,3.8 v118.72,2.35 | v121.76,5.65 120.71,4.6 119.17,4.6 v116.92,2.35 | v121.11,6.3 121.11,6 120.11,5 118.67,5 v116.03,2.35 | v111.29,118.4 111.29,118.8 113.54,121.05 114.92,121.05 v115.58,121.7 | v111.94,117.75 111.94,118.8 113.79,120.65 115.42,120.65 v116.47,121.7 | v113.24,117.75 113.24,118.8 114.29,119.85 116.42,119.85 v118.28,121.7 | v112.59,118.4 112.59,118.8 114.04,120.25 115.92,120.25 v117.38,121.7 | v113.89,118.4 114.94,119.45 116.92,119.45 v119.17,121.7 | v114.54,117.75 114.54,118.05 115.54,119.05 117.42,119.05 v120.08,121.7
X14  (via drill 0.35 pad 0.7)
  Top 0.2: v122.58,2.35 121.53,3.4 120.66,3.4 118.86,5.2 118.86,117.08 118.49,117.45 v118.49,117.75 | v123.47,2.35 122.03,3.8 120.86,3.8 119.26,5.4 119.26,117.33 119.14,117.45 v119.14,118.4 | v124.38,2.35 122.53,4.2 121.06,4.2 119.66,5.6 119.66,117.62 v119.79,117.75 | v125.28,2.35 123.03,4.6 121.26,4.6 120.06,5.8 120.06,117.08 120.44,117.45 v120.44,118.4 | v126.17,2.35 123.53,5 121.46,5 120.46,6 120.46,116.88 121.09,117.5 v121.09,117.75 | v121.67,2.35 121.03,3 120.46,3 118.46,5 118.46,116.83 117.84,117.45 v117.84,118.4 | v128.96,6.3 129.09,6.42 129.09,118.45 127.69,119.85 125.78,119.85 v123.92,121.7 | v129.61,5.65 129.61,6.6 129.49,6.73 129.49,118.65 127.89,120.25 126.28,120.25 v124.83,121.7 | v130.26,6.3 130.26,6.6 129.89,6.98 129.89,118.85 128.09,120.65 126.78,120.65 v125.72,121.7 | v130.91,5.65 130.91,6.6 130.29,7.23 130.29,119.05 128.29,121.05 127.28,121.05 v126.62,121.7 | v128.31,5.65 128.31,6.6 128.69,6.98 128.69,118.25 127.49,119.45 125.28,119.45 v123.03,121.7 | v127.66,6.3 127.66,6.55 128.29,7.17 128.29,118.05 127.29,119.05 124.78,119.05 v122.12,121.7
  Bottom 0.2: v130.91,5.65 130.91,5.25 128.66,3 127.72,3 v127.08,2.35 | v130.26,6.3 130.26,5.25 128.41,3.4 127.22,3.4 v126.17,2.35 | v128.96,6.3 128.96,5.25 127.91,4.2 126.22,4.2 v124.38,2.35 | v129.61,5.65 129.61,5.25 128.16,3.8 126.72,3.8 v125.28,2.35 | v128.31,5.65 127.26,4.6 125.72,4.6 v123.47,2.35 | v127.66,6.3 127.66,6 126.66,5 125.22,5 v122.58,2.35 | v117.84,118.4 117.84,118.8 120.09,121.05 121.47,121.05 v122.12,121.7 | v118.49,117.75 118.49,118.8 120.34,120.65 121.97,120.65 v123.03,121.7 | v119.79,117.75 119.79,118.8 120.84,119.85 122.97,119.85 v124.83,121.7 | v119.14,118.4 119.14,118.8 120.59,120.25 122.47,120.25 v123.92,121.7 | v120.44,118.4 121.49,119.45 123.47,119.45 v125.72,121.7 | v121.09,117.75 121.09,118.05 122.09,119.05 123.97,119.05 v126.62,121.7
X15  (via drill 0.35 pad 0.7)
  Top 0.2: v129.12,2.35 128.07,3.4 127.21,3.4 125.41,5.2 125.41,117.08 125.04,117.45 v125.04,117.75 | v130.03,2.35 128.57,3.8 127.41,3.8 125.81,5.4 125.81,117.33 125.69,117.45 v125.69,118.4 | v130.93,2.35 129.07,4.2 127.61,4.2 126.21,5.6 126.21,117.62 v126.34,117.75 | v131.82,2.35 129.57,4.6 127.81,4.6 126.61,5.8 126.61,117.08 126.99,117.45 v126.99,118.4 | v132.72,2.35 130.07,5 128.01,5 127.01,6 127.01,116.88 127.64,117.5 v127.64,117.75 | v128.22,2.35 127.58,3 127.01,3 125.01,5 125.01,116.83 124.39,117.45 v124.39,118.4 | v135.51,6.3 135.64,6.42 135.64,118.45 134.24,119.85 132.32,119.85 v130.47,121.7 | v136.16,5.65 136.16,6.6 136.04,6.73 136.04,118.65 134.44,120.25 132.82,120.25 v131.38,121.7 | v136.81,6.3 136.81,6.6 136.44,6.98 136.44,118.85 134.64,120.65 133.32,120.65 v132.28,121.7 | v137.46,5.65 137.46,6.6 136.84,7.23 136.84,119.05 134.84,121.05 133.82,121.05 v133.18,121.7 | v134.86,5.65 134.86,6.6 135.24,6.98 135.24,118.25 134.04,119.45 131.82,119.45 v129.57,121.7 | v134.21,6.3 134.21,6.55 134.84,7.17 134.84,118.05 133.84,119.05 131.32,119.05 v128.68,121.7
  Bottom 0.2: v137.46,5.65 137.46,5.25 135.21,3 134.28,3 v133.62,2.35 | v136.81,6.3 136.81,5.25 134.96,3.4 133.78,3.4 v132.72,2.35 | v135.51,6.3 135.51,5.25 134.46,4.2 132.78,4.2 v130.93,2.35 | v136.16,5.65 136.16,5.25 134.71,3.8 133.28,3.8 v131.82,2.35 | v134.86,5.65 133.81,4.6 132.28,4.6 v130.03,2.35 | v134.21,6.3 134.21,6 133.21,5 131.78,5 v129.12,2.35 | v124.39,118.4 124.39,118.8 126.64,121.05 128.03,121.05 v128.68,121.7 | v125.04,117.75 125.04,118.8 126.89,120.65 128.53,120.65 v129.57,121.7 | v126.34,117.75 126.34,118.8 127.39,119.85 129.53,119.85 v131.38,121.7 | v125.69,118.4 125.69,118.8 127.14,120.25 129.03,120.25 v130.47,121.7 | v126.99,118.4 128.04,119.45 130.03,119.45 v132.28,121.7 | v127.64,117.75 127.64,118.05 128.64,119.05 130.53,119.05 v133.18,121.7
X16  (via drill 0.35 pad 0.7)
  Top 0.2: v135.68,2.35 134.62,3.4 133.76,3.4 131.96,5.2 131.96,117.08 131.59,117.45 v131.59,117.75 | v136.57,2.35 135.12,3.8 133.96,3.8 132.36,5.4 132.36,117.33 132.24,117.45 v132.24,118.4 | v137.47,2.35 135.62,4.2 134.16,4.2 132.76,5.6 132.76,117.62 v132.89,117.75 | v138.38,2.35 136.12,4.6 134.36,4.6 133.16,5.8 133.16,117.08 133.54,117.45 v133.54,118.4 | v139.28,2.35 136.62,5 134.56,5 133.56,6 133.56,116.88 134.19,117.5 v134.19,117.75 | v134.78,2.35 134.12,3 133.56,3 131.56,5 131.56,116.83 130.94,117.45 v130.94,118.4 | v142.06,6.3 142.19,6.42 142.19,118.45 140.79,119.85 138.88,119.85 v137.03,121.7 | v142.71,5.65 142.71,6.6 142.59,6.73 142.59,118.65 140.99,120.25 139.38,120.25 v137.93,121.7 | v143.36,6.3 143.36,6.6 142.99,6.98 142.99,118.85 141.19,120.65 139.88,120.65 v138.82,121.7 | v144.01,5.65 144.01,6.6 143.39,7.23 143.39,119.05 141.39,121.05 140.38,121.05 v139.72,121.7 | v141.41,5.65 141.41,6.6 141.79,6.98 141.79,118.25 140.59,119.45 138.38,119.45 v136.12,121.7 | v140.76,6.3 140.76,6.55 141.39,7.17 141.39,118.05 140.39,119.05 137.88,119.05 v135.22,121.7
  Bottom 0.2: v144.01,5.65 144.01,5.25 141.76,3 140.82,3 v140.18,2.35 | v143.36,6.3 143.36,5.25 141.51,3.4 140.32,3.4 v139.28,2.35 | v142.06,6.3 142.06,5.25 141.01,4.2 139.32,4.2 v137.47,2.35 | v142.71,5.65 142.71,5.25 141.26,3.8 139.82,3.8 v138.38,2.35 | v141.41,5.65 140.36,4.6 138.82,4.6 v136.57,2.35 | v140.76,6.3 140.76,6 139.76,5 138.32,5 v135.68,2.35 | v130.94,118.4 130.94,118.8 133.19,121.05 134.57,121.05 v135.22,121.7 | v131.59,117.75 131.59,118.8 133.44,120.65 135.07,120.65 v136.12,121.7 | v132.89,117.75 132.89,118.8 133.94,119.85 136.07,119.85 v137.93,121.7 | v132.24,118.4 132.24,118.8 133.69,120.25 135.57,120.25 v137.03,121.7 | v133.54,118.4 134.59,119.45 136.57,119.45 v138.82,121.7 | v134.19,117.75 134.19,118.05 135.19,119.05 137.07,119.05 v139.72,121.7
X17  (via drill 0.35 pad 0.7)
  Top 0.2: v142.22,2.35 141.18,3.4 140.31,3.4 138.51,5.2 138.51,117.08 138.14,117.45 v138.14,117.75 | v143.12,2.35 141.68,3.8 140.51,3.8 138.91,5.4 138.91,117.33 138.79,117.45 v138.79,118.4 | v144.03,2.35 142.18,4.2 140.71,4.2 139.31,5.6 139.31,117.62 v139.44,117.75 | v144.93,2.35 142.68,4.6 140.91,4.6 139.71,5.8 139.71,117.08 140.09,117.45 v140.09,118.4 | v145.82,2.35 143.18,5 141.11,5 140.11,6 140.11,116.88 140.74,117.5 v140.74,117.75 | v141.32,2.35 140.68,3 140.11,3 138.11,5 138.11,116.83 137.49,117.45 v137.49,118.4 | v148.61,6.3 148.74,6.42 148.74,118.45 147.34,119.85 145.43,119.85 v143.57,121.7 | v149.26,5.65 149.26,6.6 149.14,6.73 149.14,118.65 147.54,120.25 145.93,120.25 v144.47,121.7 | v149.91,6.3 149.91,6.6 149.54,6.98 149.54,118.85 147.74,120.65 146.43,120.65 v145.38,121.7 | v150.56,5.65 150.56,6.6 149.94,7.23 149.94,119.05 147.94,121.05 146.93,121.05 v146.28,121.7 | v147.96,5.65 147.96,6.6 148.34,6.98 148.34,118.25 147.14,119.45 144.93,119.45 v142.68,121.7 | v147.31,6.3 147.31,6.55 147.94,7.17 147.94,118.05 146.94,119.05 144.43,119.05 v141.78,121.7
  Bottom 0.2: v150.56,5.65 150.56,5.25 148.31,3 147.38,3 v146.72,2.35 | v149.91,6.3 149.91,5.25 148.06,3.4 146.88,3.4 v145.82,2.35 | v148.61,6.3 148.61,5.25 147.56,4.2 145.88,4.2 v144.03,2.35 | v149.26,5.65 149.26,5.25 147.81,3.8 146.38,3.8 v144.93,2.35 | v147.96,5.65 146.91,4.6 145.38,4.6 v143.12,2.35 | v147.31,6.3 147.31,6 146.31,5 144.88,5 v142.22,2.35 | v137.49,118.4 137.49,118.8 139.74,121.05 141.12,121.05 v141.78,121.7 | v138.14,117.75 138.14,118.8 139.99,120.65 141.62,120.65 v142.68,121.7 | v139.44,117.75 139.44,118.8 140.49,119.85 142.62,119.85 v144.47,121.7 | v138.79,118.4 138.79,118.8 140.24,120.25 142.12,120.25 v143.57,121.7 | v140.09,118.4 141.14,119.45 143.12,119.45 v145.38,121.7 | v140.74,117.75 140.74,118.05 141.74,119.05 143.62,119.05 v146.28,121.7
X18  (via drill 0.35 pad 0.7)
  Top 0.2: v148.78,2.35 147.72,3.4 146.86,3.4 145.06,5.2 145.06,117.08 144.69,117.45 v144.69,117.75 | v149.68,2.35 148.22,3.8 147.06,3.8 145.46,5.4 145.46,117.33 145.34,117.45 v145.34,118.4 | v150.57,2.35 148.72,4.2 147.26,4.2 145.86,5.6 145.86,117.62 v145.99,117.75 | v151.47,2.35 149.22,4.6 147.46,4.6 146.26,5.8 146.26,117.08 146.64,117.45 v146.64,118.4 | v152.38,2.35 149.72,5 147.66,5 146.66,6 146.66,116.88 147.29,117.5 v147.29,117.75 | v147.88,2.35 147.22,3 146.66,3 144.66,5 144.66,116.83 144.04,117.45 v144.04,118.4 | v155.16,6.3 155.29,6.42 155.29,118.45 153.89,119.85 151.97,119.85 v150.12,121.7 | v155.81,5.65 155.81,6.6 155.69,6.73 155.69,118.65 154.09,120.25 152.47,120.25 v151.03,121.7 | v156.46,6.3 156.46,6.6 156.09,6.98 156.09,118.85 154.29,120.65 152.97,120.65 v151.93,121.7 | v157.11,5.65 157.11,6.6 156.49,7.23 156.49,119.05 154.49,121.05 153.47,121.05 v152.82,121.7 | v154.51,5.65 154.51,6.6 154.89,6.98 154.89,118.25 153.69,119.45 151.47,119.45 v149.22,121.7 | v153.86,6.3 153.86,6.55 154.49,7.17 154.49,118.05 153.49,119.05 150.97,119.05 v148.32,121.7
  Bottom 0.2: v157.11,5.65 157.11,5.25 154.86,3 153.93,3 v153.28,2.35 | v156.46,6.3 156.46,5.25 154.61,3.4 153.43,3.4 v152.38,2.35 | v155.16,6.3 155.16,5.25 154.11,4.2 152.43,4.2 v150.57,2.35 | v155.81,5.65 155.81,5.25 154.36,3.8 152.93,3.8 v151.47,2.35 | v154.51,5.65 153.46,4.6 151.93,4.6 v149.68,2.35 | v153.86,6.3 153.86,6 152.86,5 151.43,5 v148.78,2.35 | v144.04,118.4 144.04,118.8 146.29,121.05 147.68,121.05 v148.32,121.7 | v144.69,117.75 144.69,118.8 146.54,120.65 148.18,120.65 v149.22,121.7 | v145.99,117.75 145.99,118.8 147.04,119.85 149.18,119.85 v151.03,121.7 | v145.34,118.4 145.34,118.8 146.79,120.25 148.68,120.25 v150.12,121.7 | v146.64,118.4 147.69,119.45 149.68,119.45 v151.93,121.7 | v147.29,117.75 147.29,118.05 148.29,119.05 150.18,119.05 v152.82,121.7
X19  (via drill 0.35 pad 0.7)
  Top 0.2: v155.32,2.35 154.28,3.4 153.41,3.4 151.61,5.2 151.61,117.08 151.24,117.45 v151.24,117.75 | v156.22,2.35 154.78,3.8 153.61,3.8 152.01,5.4 152.01,117.33 151.89,117.45 v151.89,118.4 | v157.12,2.35 155.28,4.2 153.81,4.2 152.41,5.6 152.41,117.62 v152.54,117.75 | v158.03,2.35 155.78,4.6 154.01,4.6 152.81,5.8 152.81,117.08 153.19,117.45 v153.19,118.4 | v158.93,2.35 156.28,5 154.21,5 153.21,6 153.21,116.88 153.84,117.5 v153.84,117.75 | v154.43,2.35 153.78,3 153.21,3 151.21,5 151.21,116.83 150.59,117.45 v150.59,118.4 | v161.71,6.3 161.84,6.42 161.84,118.45 160.44,119.85 158.53,119.85 v156.68,121.7 | v162.36,5.65 162.36,6.6 162.24,6.73 162.24,118.65 160.64,120.25 159.03,120.25 v157.57,121.7 | v163.01,6.3 163.01,6.6 162.64,6.98 162.64,118.85 160.84,120.65 159.53,120.65 v158.47,121.7 | v163.66,5.65 163.66,6.6 163.04,7.23 163.04,119.05 161.04,121.05 160.03,121.05 v159.38,121.7 | v161.06,5.65 161.06,6.6 161.44,6.98 161.44,118.25 160.24,119.45 158.03,119.45 v155.78,121.7 | v160.41,6.3 160.41,6.55 161.04,7.17 161.04,118.05 160.04,119.05 157.53,119.05 v154.88,121.7
  Bottom 0.2: v163.66,5.65 163.66,5.25 161.41,3 160.47,3 v159.82,2.35 | v163.01,6.3 163.01,5.25 161.16,3.4 159.97,3.4 v158.93,2.35 | v161.71,6.3 161.71,5.25 160.66,4.2 158.97,4.2 v157.12,2.35 | v162.36,5.65 162.36,5.25 160.91,3.8 159.47,3.8 v158.03,2.35 | v161.06,5.65 160.01,4.6 158.47,4.6 v156.22,2.35 | v160.41,6.3 160.41,6 159.41,5 157.97,5 v155.32,2.35 | v150.59,118.4 150.59,118.8 152.84,121.05 154.22,121.05 v154.88,121.7 | v151.24,117.75 151.24,118.8 153.09,120.65 154.72,120.65 v155.78,121.7 | v152.54,117.75 152.54,118.8 153.59,119.85 155.72,119.85 v157.57,121.7 | v151.89,118.4 151.89,118.8 153.34,120.25 155.22,120.25 v156.68,121.7 | v153.19,118.4 154.24,119.45 156.22,119.45 v158.47,121.7 | v153.84,117.75 153.84,118.05 154.84,119.05 156.72,119.05 v159.38,121.7
X20  (via drill 0.35 pad 0.7)
  Top 0.2: v161.88,2.35 160.82,3.4 159.96,3.4 158.16,5.2 158.16,117.08 157.79,117.45 v157.79,117.75 | v162.78,2.35 161.32,3.8 160.16,3.8 158.56,5.4 158.56,117.33 158.44,117.45 v158.44,118.4 | v163.68,2.35 161.82,4.2 160.36,4.2 158.96,5.6 158.96,117.62 v159.09,117.75 | v164.57,2.35 162.32,4.6 160.56,4.6 159.36,5.8 159.36,117.08 159.74,117.45 v159.74,118.4 | v165.47,2.35 162.82,5 160.76,5 159.76,6 159.76,116.88 160.39,117.5 v160.39,117.75 | v160.97,2.35 160.32,3 159.76,3 157.76,5 157.76,116.83 157.14,117.45 v157.14,118.4 | v168.26,6.3 168.39,6.42 168.39,118.45 166.99,119.85 165.07,119.85 v163.22,121.7 | v168.91,5.65 168.91,6.6 168.79,6.73 168.79,118.65 167.19,120.25 165.57,120.25 v164.12,121.7 | v169.56,6.3 169.56,6.6 169.19,6.98 169.19,118.85 167.39,120.65 166.07,120.65 v165.03,121.7 | v170.21,5.65 170.21,6.6 169.59,7.23 169.59,119.05 167.59,121.05 166.57,121.05 v165.93,121.7 | v167.61,5.65 167.61,6.6 167.99,6.98 167.99,118.25 166.79,119.45 164.57,119.45 v162.32,121.7 | v166.96,6.3 166.96,6.55 167.59,7.17 167.59,118.05 166.59,119.05 164.07,119.05 v161.43,121.7
  Bottom 0.2: v170.21,5.65 170.21,5.25 167.96,3 167.03,3 v166.38,2.35 | v169.56,6.3 169.56,5.25 167.71,3.4 166.53,3.4 v165.47,2.35 | v168.26,6.3 168.26,5.25 167.21,4.2 165.53,4.2 v163.68,2.35 | v168.91,5.65 168.91,5.25 167.46,3.8 166.03,3.8 v164.57,2.35 | v167.61,5.65 166.56,4.6 165.03,4.6 v162.78,2.35 | v166.96,6.3 166.96,6 165.96,5 164.53,5 v161.88,2.35 | v157.14,118.4 157.14,118.8 159.39,121.05 160.78,121.05 v161.43,121.7 | v157.79,117.75 157.79,118.8 159.64,120.65 161.28,120.65 v162.32,121.7 | v159.09,117.75 159.09,118.8 160.14,119.85 162.28,119.85 v164.12,121.7 | v158.44,118.4 158.44,118.8 159.89,120.25 161.78,120.25 v163.22,121.7 | v159.74,118.4 160.79,119.45 162.78,119.45 v165.03,121.7 | v160.39,117.75 160.39,118.05 161.39,119.05 163.28,119.05 v165.93,121.7
X21  (via drill 0.35 pad 0.7)
  Top 0.2: v168.43,2.35 167.38,3.4 166.51,3.4 164.71,5.2 164.71,117.08 164.34,117.45 v164.34,117.75 | v169.32,2.35 167.88,3.8 166.71,3.8 165.11,5.4 165.11,117.33 164.99,117.45 v164.99,118.4 | v170.22,2.35 168.38,4.2 166.91,4.2 165.51,5.6 165.51,117.62 v165.64,117.75 | v171.12,2.35 168.88,4.6 167.11,4.6 165.91,5.8 165.91,117.08 166.29,117.45 v166.29,118.4 | v172.03,2.35 169.38,5 167.31,5 166.31,6 166.31,116.88 166.94,117.5 v166.94,117.75 | v167.53,2.35 166.88,3 166.31,3 164.31,5 164.31,116.83 163.69,117.45 v163.69,118.4 | v174.81,6.3 174.94,6.42 174.94,118.45 173.54,119.85 171.62,119.85 v169.78,121.7 | v175.46,5.65 175.46,6.6 175.34,6.73 175.34,118.65 173.74,120.25 172.12,120.25 v170.68,121.7 | v176.11,6.3 176.11,6.6 175.74,6.98 175.74,118.85 173.94,120.65 172.62,120.65 v171.57,121.7 | v176.76,5.65 176.76,6.6 176.14,7.23 176.14,119.05 174.14,121.05 173.12,121.05 v172.47,121.7 | v174.16,5.65 174.16,6.6 174.54,6.98 174.54,118.25 173.34,119.45 171.12,119.45 v168.88,121.7 | v173.51,6.3 173.51,6.55 174.14,7.17 174.14,118.05 173.14,119.05 170.62,119.05 v167.97,121.7
  Bottom 0.2: v176.76,5.65 176.76,5.25 174.51,3 173.57,3 v172.93,2.35 | v176.11,6.3 176.11,5.25 174.26,3.4 173.07,3.4 v172.03,2.35 | v174.81,6.3 174.81,5.25 173.76,4.2 172.07,4.2 v170.22,2.35 | v175.46,5.65 175.46,5.25 174.01,3.8 172.57,3.8 v171.12,2.35 | v174.16,5.65 173.11,4.6 171.57,4.6 v169.32,2.35 | v173.51,6.3 173.51,6 172.51,5 171.07,5 v168.43,2.35 | v163.69,118.4 163.69,118.8 165.94,121.05 167.32,121.05 v167.97,121.7 | v164.34,117.75 164.34,118.8 166.19,120.65 167.82,120.65 v168.88,121.7 | v165.64,117.75 165.64,118.8 166.69,119.85 168.82,119.85 v170.68,121.7 | v164.99,118.4 164.99,118.8 166.44,120.25 168.32,120.25 v169.78,121.7 | v166.29,118.4 167.34,119.45 169.32,119.45 v171.57,121.7 | v166.94,117.75 166.94,118.05 167.94,119.05 169.82,119.05 v172.47,121.7
X22  (via drill 0.35 pad 0.7)
  Top 0.2: v174.97,2.35 173.93,3.4 173.06,3.4 171.26,5.2 171.26,117.08 170.89,117.45 v170.89,117.75 | v175.88,2.35 174.43,3.8 173.26,3.8 171.66,5.4 171.66,117.33 171.54,117.45 v171.54,118.4 | v176.78,2.35 174.93,4.2 173.46,4.2 172.06,5.6 172.06,117.62 v172.19,117.75 | v177.68,2.35 175.43,4.6 173.66,4.6 172.46,5.8 172.46,117.08 172.84,117.45 v172.84,118.4 | v178.57,2.35 175.93,5 173.86,5 172.86,6 172.86,116.88 173.49,117.5 v173.49,117.75 | v174.07,2.35 173.43,3 172.86,3 170.86,5 170.86,116.83 170.24,117.45 v170.24,118.4 | v181.36,6.3 181.49,6.42 181.49,118.45 180.09,119.85 178.18,119.85 v176.32,121.7 | v182.01,5.65 182.01,6.6 181.89,6.73 181.89,118.65 180.29,120.25 178.68,120.25 v177.22,121.7 | v182.66,6.3 182.66,6.6 182.29,6.98 182.29,118.85 180.49,120.65 179.18,120.65 v178.12,121.7 | v183.31,5.65 183.31,6.6 182.69,7.23 182.69,119.05 180.69,121.05 179.68,121.05 v179.03,121.7 | v180.71,5.65 180.71,6.6 181.09,6.98 181.09,118.25 179.89,119.45 177.68,119.45 v175.43,121.7 | v180.06,6.3 180.06,6.55 180.69,7.17 180.69,118.05 179.69,119.05 177.18,119.05 v174.53,121.7
  Bottom 0.2: v183.31,5.65 183.31,5.25 181.06,3 180.12,3 v179.47,2.35 | v182.66,6.3 182.66,5.25 180.81,3.4 179.62,3.4 v178.57,2.35 | v181.36,6.3 181.36,5.25 180.31,4.2 178.62,4.2 v176.78,2.35 | v182.01,5.65 182.01,5.25 180.56,3.8 179.12,3.8 v177.68,2.35 | v180.71,5.65 179.66,4.6 178.12,4.6 v175.88,2.35 | v180.06,6.3 180.06,6 179.06,5 177.62,5 v174.97,2.35 | v170.24,118.4 170.24,118.8 172.49,121.05 173.88,121.05 v174.53,121.7 | v170.89,117.75 170.89,118.8 172.74,120.65 174.38,120.65 v175.43,121.7 | v172.19,117.75 172.19,118.8 173.24,119.85 175.38,119.85 v177.22,121.7 | v171.54,118.4 171.54,118.8 172.99,120.25 174.88,120.25 v176.32,121.7 | v172.84,118.4 173.89,119.45 175.88,119.45 v178.12,121.7 | v173.49,117.75 173.49,118.05 174.49,119.05 176.38,119.05 v179.03,121.7
X23  (via drill 0.35 pad 0.7)
  Top 0.2: v181.53,2.35 180.47,3.4 179.61,3.4 177.81,5.2 177.81,117.08 177.44,117.45 v177.44,117.75 | v182.43,2.35 180.97,3.8 179.81,3.8 178.21,5.4 178.21,117.33 178.09,117.45 v178.09,118.4 | v183.32,2.35 181.47,4.2 180.01,4.2 178.61,5.6 178.61,117.62 v178.74,117.75 | v184.22,2.35 181.97,4.6 180.21,4.6 179.01,5.8 179.01,117.08 179.39,117.45 v179.39,118.4 | v185.12,2.35 182.47,5 180.41,5 179.41,6 179.41,116.88 180.04,117.5 v180.04,117.75 | v180.62,2.35 179.97,3 179.41,3 177.41,5 177.41,116.83 176.79,117.45 v176.79,118.4 | v187.91,6.3 188.04,6.42 188.04,118.45 186.64,119.85 184.72,119.85 v182.88,121.7 | v188.56,5.65 188.56,6.6 188.44,6.73 188.44,118.65 186.84,120.25 185.22,120.25 v183.78,121.7 | v189.21,6.3 189.21,6.6 188.84,6.98 188.84,118.85 187.04,120.65 185.72,120.65 v184.68,121.7 | v189.86,5.65 189.86,6.6 189.24,7.23 189.24,119.05 187.24,121.05 186.22,121.05 v185.57,121.7 | v187.26,5.65 187.26,6.6 187.64,6.98 187.64,118.25 186.44,119.45 184.22,119.45 v181.97,121.7 | v186.61,6.3 186.61,6.55 187.24,7.17 187.24,118.05 186.24,119.05 183.72,119.05 v181.07,121.7
  Bottom 0.2: v189.86,5.65 189.86,5.25 187.61,3 186.68,3 v186.03,2.35 | v189.21,6.3 189.21,5.25 187.36,3.4 186.18,3.4 v185.12,2.35 | v187.91,6.3 187.91,5.25 186.86,4.2 185.18,4.2 v183.32,2.35 | v188.56,5.65 188.56,5.25 187.11,3.8 185.68,3.8 v184.22,2.35 | v187.26,5.65 186.21,4.6 184.68,4.6 v182.43,2.35 | v186.61,6.3 186.61,6 185.61,5 184.18,5 v181.53,2.35 | v176.79,118.4 176.79,118.8 179.04,121.05 180.43,121.05 v181.07,121.7 | v177.44,117.75 177.44,118.8 179.29,120.65 180.93,120.65 v181.97,121.7 | v178.74,117.75 178.74,118.8 179.79,119.85 181.93,119.85 v183.78,121.7 | v178.09,118.4 178.09,118.8 179.54,120.25 181.43,120.25 v182.88,121.7 | v179.39,118.4 180.44,119.45 182.43,119.45 v184.68,121.7 | v180.04,117.75 180.04,118.05 181.04,119.05 182.93,119.05 v185.57,121.7
Y0  (via drill 0.35 pad 0.7)
  Top 0.2: v25.45,6.34 25.05,6.34 22.8,8.59 22.8,9.52 v22.15,10.17 | v26.1,6.99 25.05,6.99 23.2,8.84 23.2,10.02 v22.15,11.08 | v26.1,8.29 25.05,8.29 24,9.34 24,11.02 v22.15,12.88 | v25.45,7.64 25.05,7.64 23.6,9.09 23.6,10.52 v22.15,11.98 | v25.45,8.94 24.4,9.99 24.4,11.52 v22.15,13.77 | v26.1,9.59 25.8,9.59 24.8,10.59 24.8,12.02 v22.15,14.67 | v190.55,19.41 190.95,19.41 193.2,17.16 193.2,15.77 v193.85,15.12 | v189.9,18.76 190.95,18.76 192.8,16.91 192.8,15.27 v193.85,14.23 | v189.9,17.46 190.95,17.46 192,16.41 192,14.27 v193.85,12.42 | v190.55,18.11 190.95,18.11 192.4,16.66 192.4,14.77 v193.85,13.33 | v190.55,16.81 191.6,15.76 191.6,13.77 v193.85,11.52 | v189.9,16.16 190.2,16.16 191.2,15.16 191.2,13.27 v193.85,10.62
  Bottom 0.2: v22.15,14.67 23.2,15.73 23.2,16.59 25,18.39 189.22,18.39 189.6,18.76 v189.9,18.76 | v22.15,13.77 23.6,15.23 23.6,16.39 25.2,17.99 189.47,17.99 189.6,18.11 v190.55,18.11 | v22.15,12.88 24,14.73 24,16.19 25.4,17.59 189.78,17.59 v189.9,17.46 | v22.15,11.98 24.4,14.23 24.4,15.99 25.6,17.19 189.22,17.19 189.6,16.81 v190.55,16.81 | v22.15,11.08 24.8,13.73 24.8,15.79 25.8,16.79 189.03,16.79 189.65,16.16 v189.9,16.16 | v22.15,15.58 22.8,16.23 22.8,16.79 24.8,18.79 188.97,18.79 189.6,19.41 v190.55,19.41 | v26.1,8.29 26.22,8.16 190.6,8.16 192,9.56 192,11.48 v193.85,13.33 | v25.45,7.64 26.4,7.64 26.53,7.76 190.8,7.76 192.4,9.36 192.4,10.98 v193.85,12.42 | v26.1,6.99 26.4,6.99 26.78,7.36 191,7.36 192.8,9.16 192.8,10.48 v193.85,11.52 | v25.45,6.34 26.4,6.34 27.03,6.96 191.2,6.96 193.2,8.96 193.2,9.98 v193.85,10.62 | v25.45,8.94 26.4,8.94 26.78,8.56 190.4,8.56 191.6,9.76 191.6,11.98 v193.85,14.23 | v26.1,9.59 26.35,9.59 26.97,8.96 190.2,8.96 191.2,9.96 191.2,12.48 v193.85,15.12
Y1  (via drill 0.35 pad 0.7)
  Top 0.2: v25.45,12.89 25.05,12.89 22.8,15.14 22.8,16.08 v22.15,16.73 | v26.1,13.54 25.05,13.54 23.2,15.39 23.2,16.58 v22.15,17.62 | v26.1,14.84 25.05,14.84 24,15.89 24,17.58 v22.15,19.42 | v25.45,14.19 25.05,14.19 23.6,15.64 23.6,17.08 v22.15,18.52 | v25.45,15.49 24.4,16.54 24.4,18.08 v22.15,20.33 | v26.1,16.14 25.8,16.14 24.8,17.14 24.8,18.58 v22.15,21.23 | v190.55,25.96 190.95,25.96 193.2,23.71 193.2,22.33 v193.85,21.67 | v189.9,25.31 190.95,25.31 192.8,23.46 192.8,21.83 v193.85,20.77 | v189.9,24.01 190.95,24.01 192,22.96 192,20.83 v193.85,18.98 | v190.55,24.66 190.95,24.66 192.4,23.21 192.4,21.33 v193.85,19.88 | v190.55,23.36 191.6,22.31 191.6,20.33 v193.85,18.08 | v189.9,22.71 190.2,22.71 191.2,21.71 191.2,19.83 v193.85,17.17
  Bottom 0.2: v22.15,21.23 23.2,22.27 23.2,23.14 25,24.94 189.22,24.94 189.6,25.31 v189.9,25.31 | v22.15,20.33 23.6,21.77 23.6,22.94 25.2,24.54 189.47,24.54 189.6,24.66 v190.55,24.66 | v22.15,19.42 24,21.27 24,22.74 25.4,24.14 189.78,24.14 v189.9,24.01 | v22.15,18.52 24.4,20.77 24.4,22.54 25.6,23.74 189.22,23.74 189.6,23.36 v190.55,23.36 | v22.15,17.62 24.8,20.27 24.8,22.34 25.8,23.34 189.03,23.34 189.65,22.71 v189.9,22.71 | v22.15,22.12 22.8,22.77 22.8,23.34 24.8,25.34 188.97,25.34 189.6,25.96 v190.55,25.96 | v26.1,14.84 26.22,14.71 190.6,14.71 192,16.11 192,18.02 v193.85,19.88 | v25.45,14.19 26.4,14.19 26.53,14.31 190.8,14.31 192.4,15.91 192.4,17.52 v193.85,18.98 | v26.1,13.54 26.4,13.54 26.78,13.91 191,13.91 192.8,15.71 192.8,17.02 v193.85,18.08 | v25.45,12.89 26.4,12.89 27.03,13.51 191.2,13.51 193.2,15.51 193.2,16.52 v193.85,17.17 | v25.45,15.49 26.4,15.49 26.78,15.11 190.4,15.11 191.6,16.31 191.6,18.52 v193.85,20.77 | v26.1,16.14 26.35,16.14 26.97,15.51 190.2,15.51 191.2,16.51 191.2,19.02 v193.85,21.67
Y2  (via drill 0.35 pad 0.7)